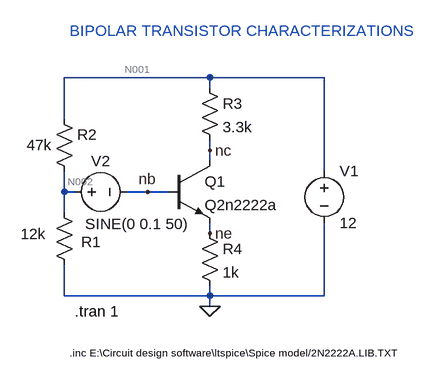
[diagram p0: schematic bjt_small_signal_analysis.asc]
bjt_small_signal_analysis.asc, the LTspice schematic file:
Version 4
SHEET 1 880 680
WIRE 208 16 -16 16
WIRE 384 16 208 16
WIRE 208 32 208 16
WIRE -16 80 -16 16
WIRE 208 128 208 112
WIRE 208 144 208 128
WIRE 384 160 384 16
WIRE -16 192 -16 160
WIRE 0 192 -16 192
WIRE 112 192 80 192
WIRE 144 192 112 192
WIRE -16 224 -16 192
WIRE 208 256 208 240
WIRE -16 352 -16 304
WIRE 208 352 208 336
WIRE 208 352 -16 352
WIRE 384 352 384 240
WIRE 384 352 208 352
WIRE 208 368 208 352
FLAG 208 368 0
FLAG 208 128 nc
FLAG 208 256 ne
FLAG 112 192 nb
SYMBOL npn3 144 144 R0
SYMATTR InstName Q1
SYMATTR Value Q2n2222a
SYMBOL res -32 208 R0
WINDOW 0 42 61 Left 2
WINDOW 3 -51 49 Left 2
SYMATTR InstName R1
SYMATTR Value 12k
SYMBOL res -32 64 R0
WINDOW 3 -42 56 Left 2
SYMATTR InstName R2
SYMATTR Value 47k
SYMBOL res 192 16 R0
SYMATTR InstName R3
SYMATTR Value 3.3k
SYMBOL res 192 240 R0
SYMATTR InstName R4
SYMATTR Value 1k
SYMBOL voltage 384 144 R0
WINDOW 123 0 0 Left 0
WINDOW 39 0 0 Left 0
SYMATTR InstName V1
SYMATTR Value 12
SYMBOL voltage -16 192 R270
WINDOW 0 32 56 VTop 2
WINDOW 3 -34 112 VBottom 2
WINDOW 123 0 0 Left 0
WINDOW 39 0 0 Left 0
SYMATTR InstName V2
SYMATTR Value SINE(0 0.1 50)
TEXT -8 440 Left 1 !.inc E:\\Circuit design software\\ltspice\\Spice model/2N2222A.LIB.TXT
TEXT 0 376 Left 2 !.tran 1
TEXT -8 -56 Left 2 ;BIPOLAR TRANSISTOR CHARACTERIZATIONS

The netlist it stands for:
* bjt_small_signal_analysis.asc
Q1 nc nb ne 0 Q2n2222a
R1 N002 0 12k
R2 N001 N002 47k
R3 N001 nc 3.3k
R4 ne 0 1k
V1 N001 0 12
V2 N002 nb SINE(0 0.1 50)
.model NPN NPN
.model PNP PNP
.lib standard.bjt
.inc E:\Circuit design software\ltspice\Spice model/2N2222A.LIB.TXT
.tran 1
* BIPOLAR TRANSISTOR CHARACTERIZATIONS
.backanno
.end

* Results of the author's LTspice run, read from the files saved beside the schematic
* Operating Point, zero values left out:
*   V(nc) = 6.636 V
*   V(nb) = 2.332 V
*   V(ne) = 1.637 V
*   V(n002) = 2.332 V
*   V(n001) = 12 V
*   Ic(Q1) = 1.626 mA
*   Ib(Q1) = 11.41 µA
*   Ie(Q1) = -1.637 mA
*   I(R4) = 1.637 mA
*   I(R3) = 1.626 mA
*   I(R2) = 205.7 µA
*   I(R1) = 194.3 µA
*   I(V2) = 11.41 µA
*   I(V1) = -1.831 mA
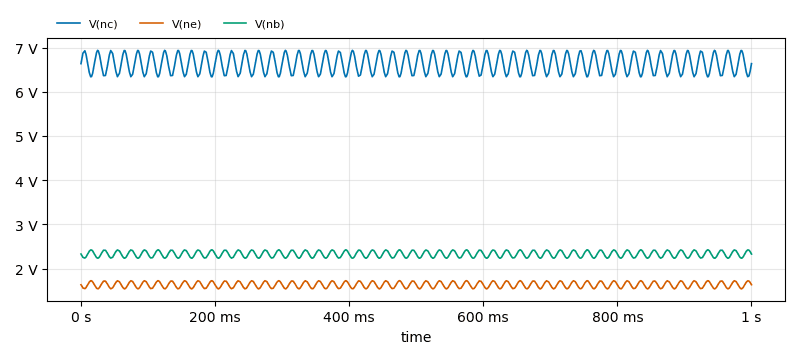
[diagram p1: Transient Analysis of bjt_small_signal_analysis.asc, plotted from the saved traces]
* Transient Analysis, 1 run:
*   V(nc): min 6.338 V, max 6.936 V, average 6.637 V, rms 6.64 V, last 6.636 V
*   V(ne): min 1.545 V, max 1.728 V, average 1.637 V, rms 1.638 V, last 1.637 V
*   V(nb): min 2.237 V, max 2.425 V, average 2.331 V, rms 2.332 V, last 2.332 V